# Altium schematic sheet USB-C_(TH).SchDoc
size A4; DrawnBy: JimBobJones; DocumentNumber: 4; SheetNumber: 4; SheetTotal: 4
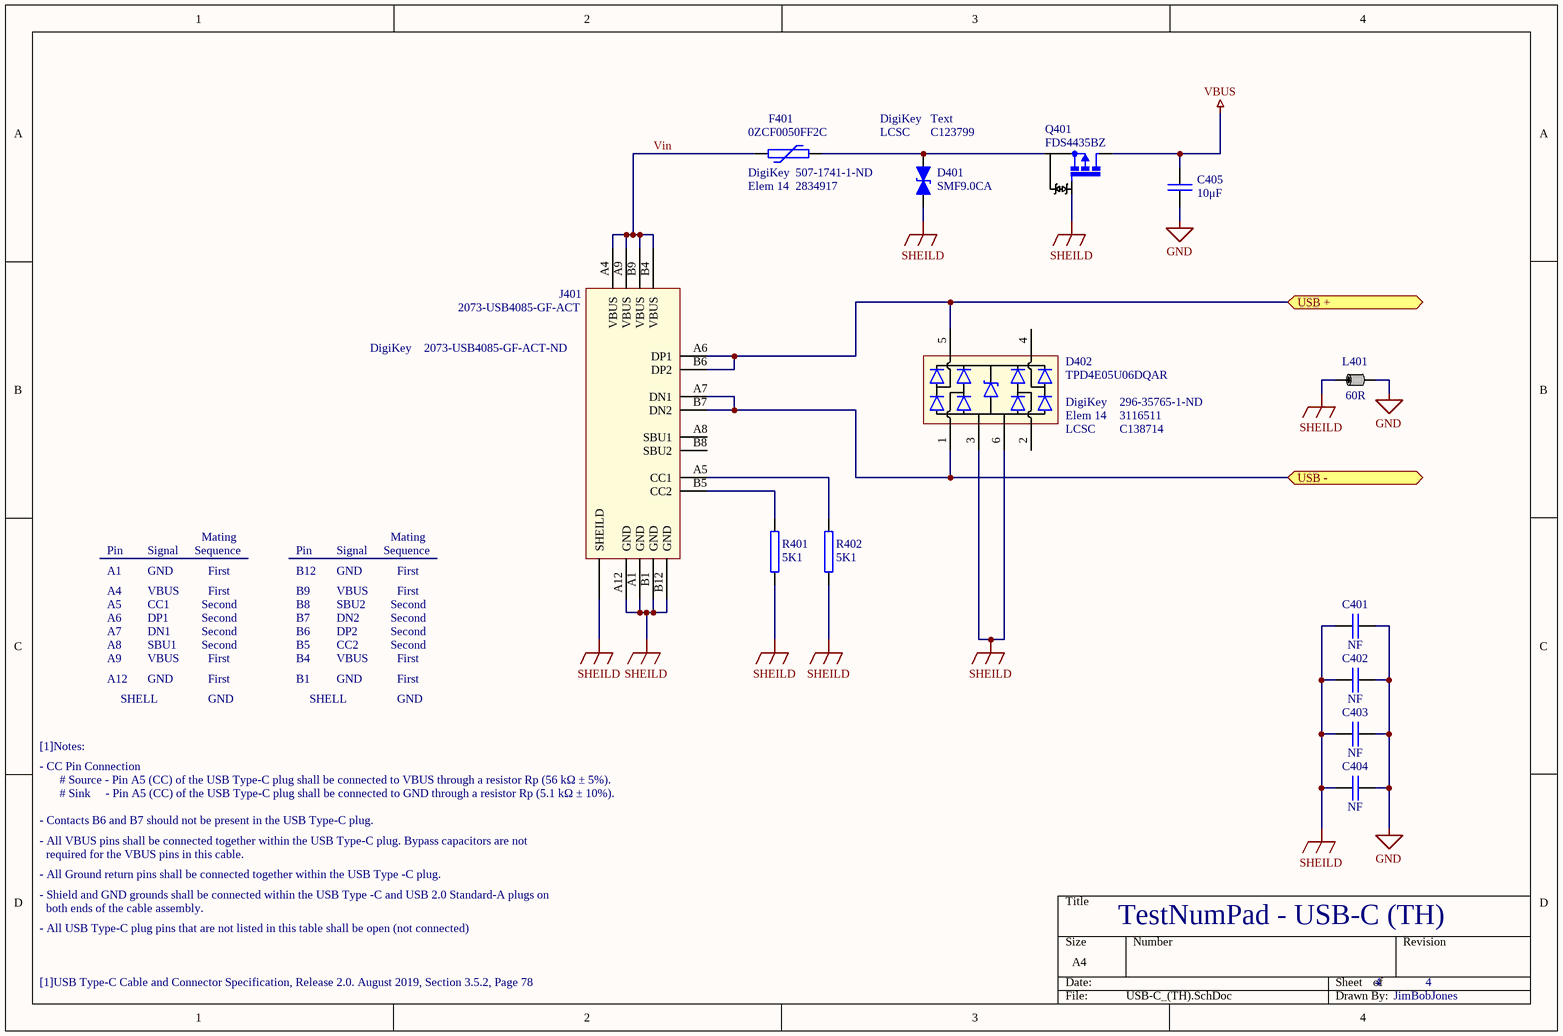
[diagram p0: USB-C_(TH).SchDoc]

## Parts
C401  NF  [2012C (0805)]
C402  NF  [2012C (0805)]
C403  NF  [2012C (0805)]
C404  NF  [2012C (0805)]
C405  10μF  [3216C (1206)]
D401  SMF9.0CA  [SOD-123FL]
D402  TPD4E05U06DQAR  [USON-10]
F401  0ZCF0050FF2C  Supplier Part Number 1: 507-1741-1-ND  Supplier Part Number 2: 2834917  [7351 (2920)]
J401  2073-USB4085-GF-ACT  Supplier Part Number 1: 2073-USB4085-GF-ACT-ND  [USB-C (2.0,TH)]
L401  60R  [3216 (1206)]
Q401  FDS4435BZ  [SO8-150/200mil-GDS]
R401  5K1  [2012R-5K1]
R402  5K1  [2012R-5K1]

## Ports
USB + (bidir), USB - (bidir)

## Nets
GND: C401.2 C402.2 C403.2 C404.2 C405.2 L401.2
SHEILD: C401.1 C402.1 C403.1 C404.1 D401.K D402.3 D402.6 J401.A1(GND) J401.A12(GND) J401.B1(GND) J401.B12(GND) J401.SHEILD L401.1 Q401.G R401.2 R402.2
VBUS: C405.1 Q401.D
USB +: D402.5 J401.A6(DP1) J401.B6(DP2) ; port USB +
USB -: D402.1 J401.A7(DN1) J401.B7(DN2) ; port USB -
Vin: F401.1 J401.A4(VBUS) J401.A9(VBUS) J401.B4(VBUS) J401.B9(VBUS)
NetD401_A: D401.A F401.2 Q401.S
NetJ401_A5: J401.A5(CC1) R402.1
NetJ401_B5: J401.B5(CC2) R401.1

Not connected (* = marked no-connect by the designer): D402 2 4; J401 A8(SBU1) B8(SBU2)

## Notes on the sheet
- (near F401) DigiKey
- (near D401) DigiKey
- (near D401) LCSC
- (near D401) Text
- (near D401) C123799
- (near F401) Elem 14
- DigiKey
- (near D402) DigiKey
- (near D402) Elem 14
- (near D402) LCSC
- 296-35765-1-ND
- 3116511
- C138714
- Pin
- A1
- Signal
- GND
- Sequence
- Mating
- First
- B12
- A4
- A5
- A6
- A7
- A8
- VBUS
- CC1
- DP1
- DN1
- SBU1
- Second
- B9
- B8
- B7
- B6
- B5
- SBU2
- DN2
- DP2
- CC2
- A9
- A12
- SHELL
- B4
- B1
- [1]Notes:
- - CC Pin Connection
- # Source - Pin A5 (CC) of the USB Type-C plug shall be connected to VBUS through a resistor Rp (56 kΩ ± 5%).
- - Contacts B6 and B7 should not be present in the USB Type-C plug.
- - All VBUS pins shall be connected together within the USB Type-C plug. Bypass capacitors are not
- # Sink     - Pin A5 (CC) of the USB Type-C plug shall be connected to GND through a resistor Rp (5.1 kΩ ± 10%).
- - All Ground return pins shall be connected together within the USB Type -C plug.
- - Shield and GND grounds shall be connected within the USB Type -C and USB 2.0 Standard-A plugs on
- required for the VBUS pins in this cable.
- both ends of the cable assembly.
- [1]USB Type-C Cable and Connector Specification, Release 2.0. August 2019, Section 3.5.2, Page 78
- - All USB Type-C plug pins that are not listed in this table shall be open (not connected)
- TestNumPad - USB-C (TH)

## Library data of the parts
C401-C404 = 2012C-100nF: 2012 100nF MLCC Capacitor 50V X7R
C405 = 3216C-10uF: 3216, 25V MLCC X5R CAPACITOR
D401 = Diode-TVS-SMF9.0CA: Bi-Directional TVS Diode, Vbr 10V, Vcl 15.4V, 13A, 200W
D402 = Diode-ESD Array_1: TVS Array, Low Capacitance, ESD Protection, 4IO + Pwr, (<3.0pF)
F401 = Poly-miniSMDC150F: Ih-0.5A, It-1A, Im-100A, 60V POLYFUSE; Supplier 1: Digi-Key; Supplier 2: Element14
J401 = USB-C (2.0,TH): USB 2.0 Type-C Connector, 16 Pin, TH + TH Case; Supplier 1: Digi-Key
L401 = FERRITE BEAD: SMD Ferrite Bead
Q401 = FDS4435BZ: P-channel, 30V, 3.2A, 120-75mOhm Enhancement MOSFET with 3.8Kv ESD Protection
R401 R402 = 2012R-5K1: RESISTOR 2012 1/4 WATT THIN FILM; Reel: *